# EAGLE board A314v1.2 (EAGLE 7.7.0)
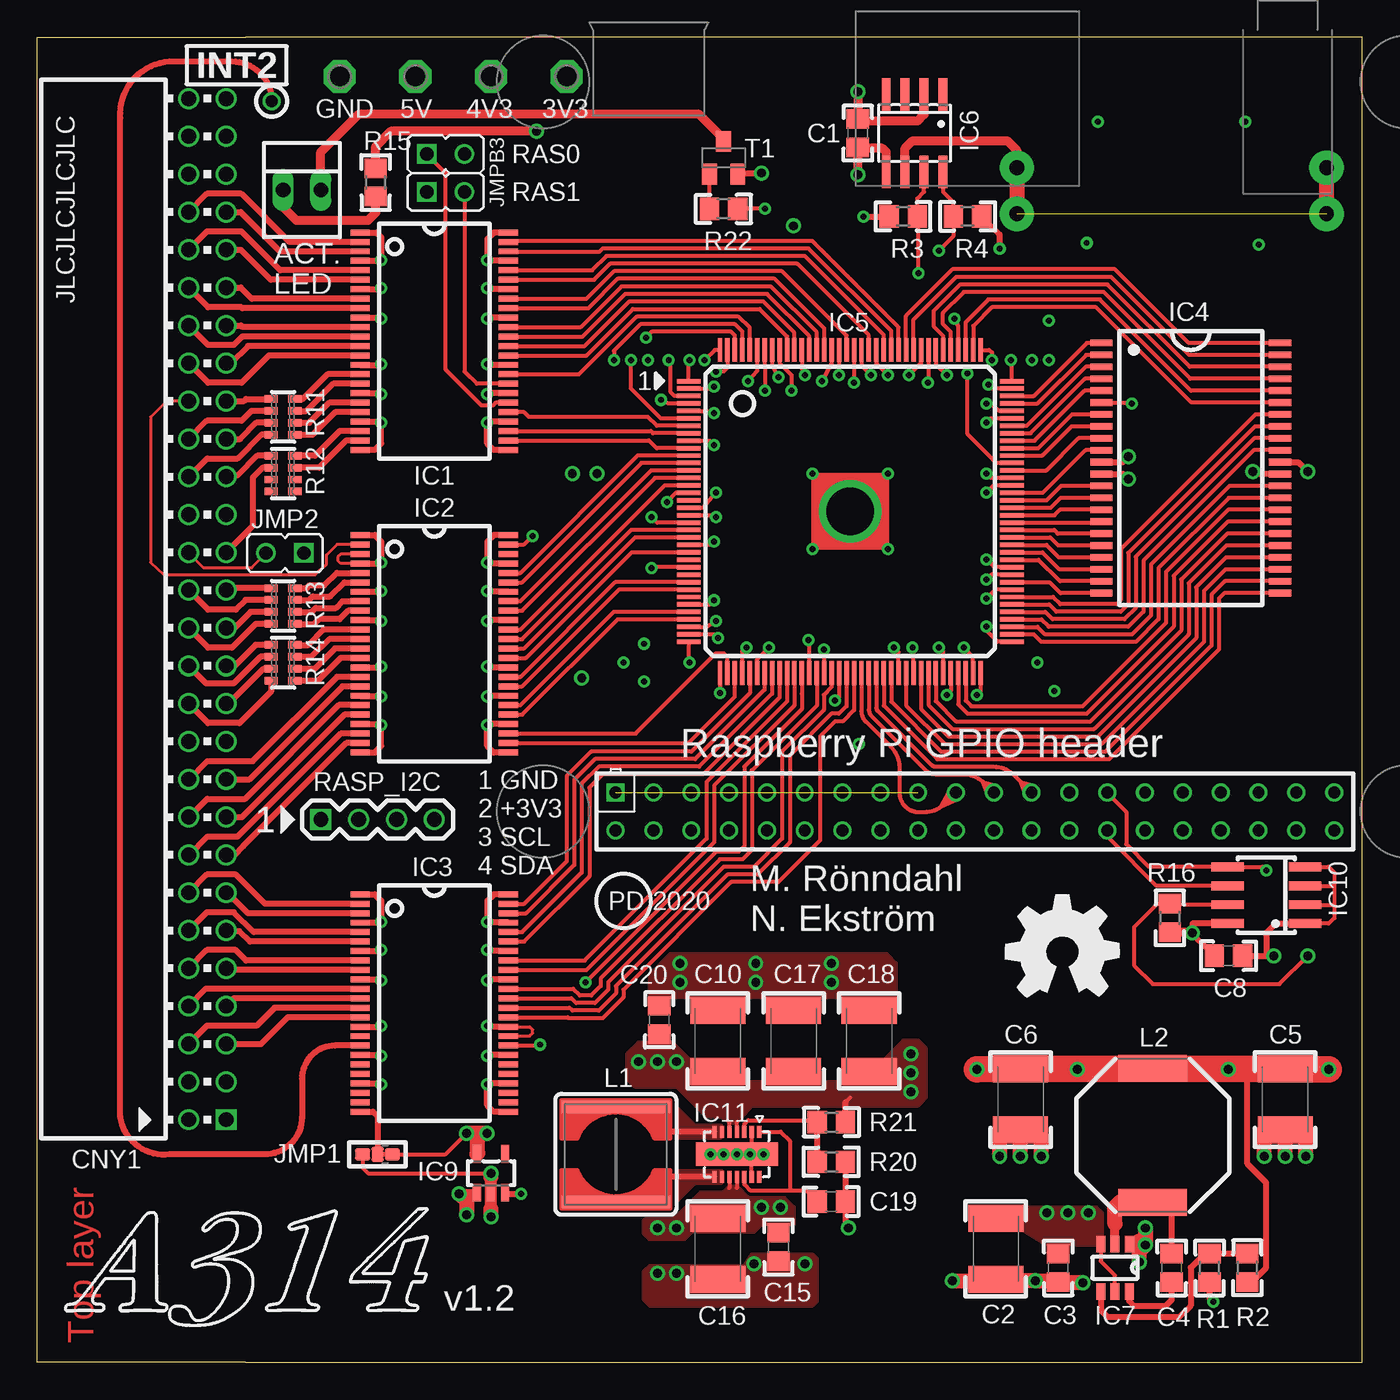
[diagram p4: board, top side]
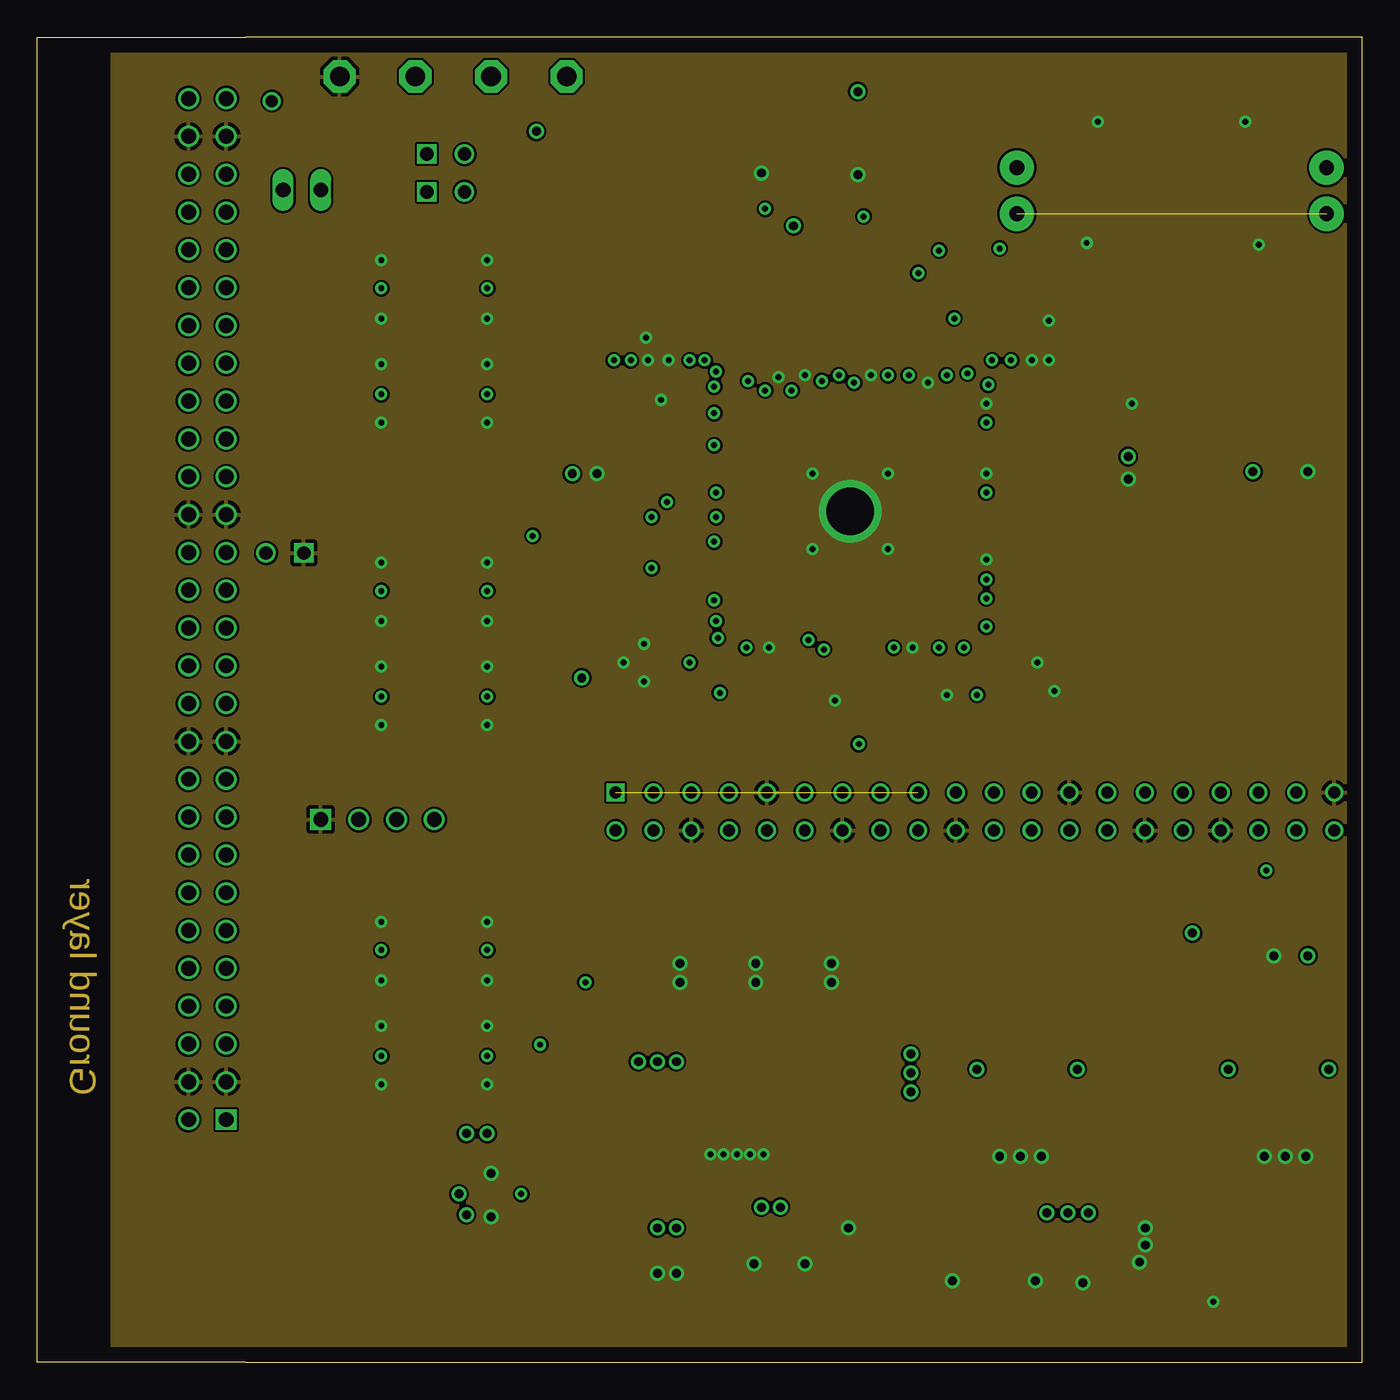
[diagram p5: board, inner layer Ground]
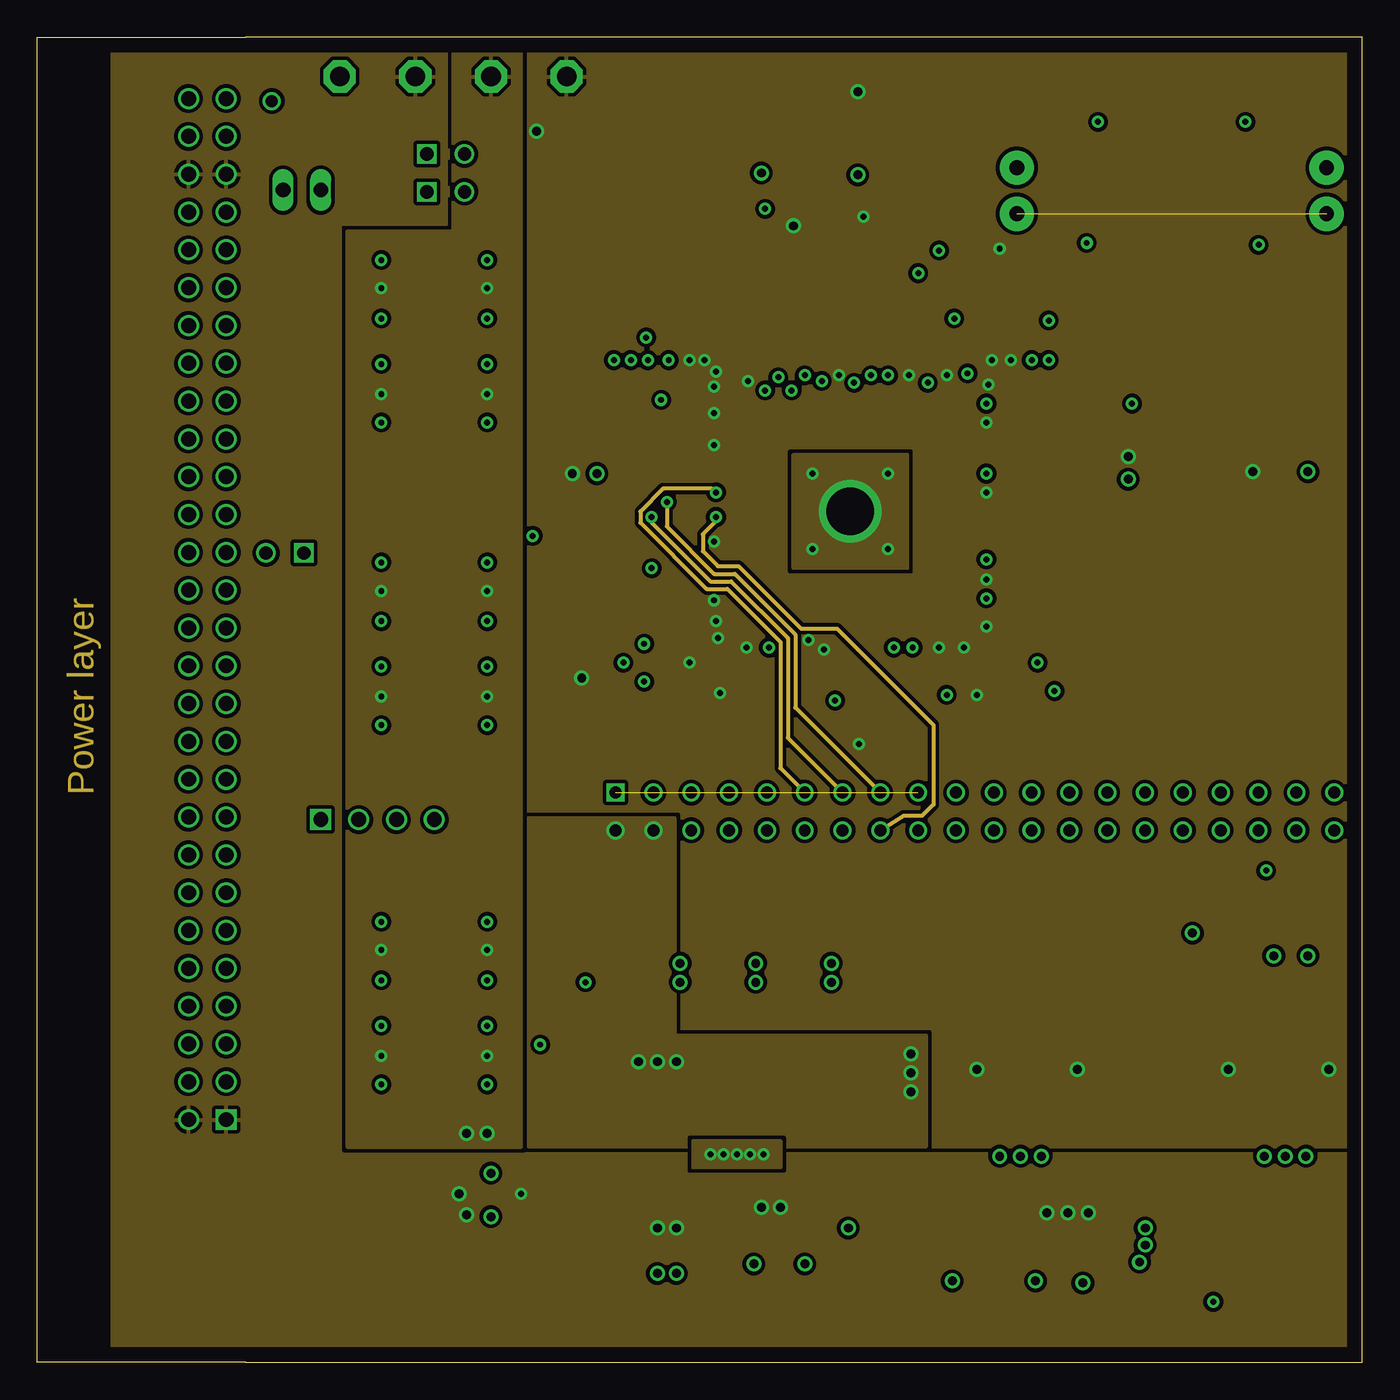
[diagram p6: board, inner layer Power]
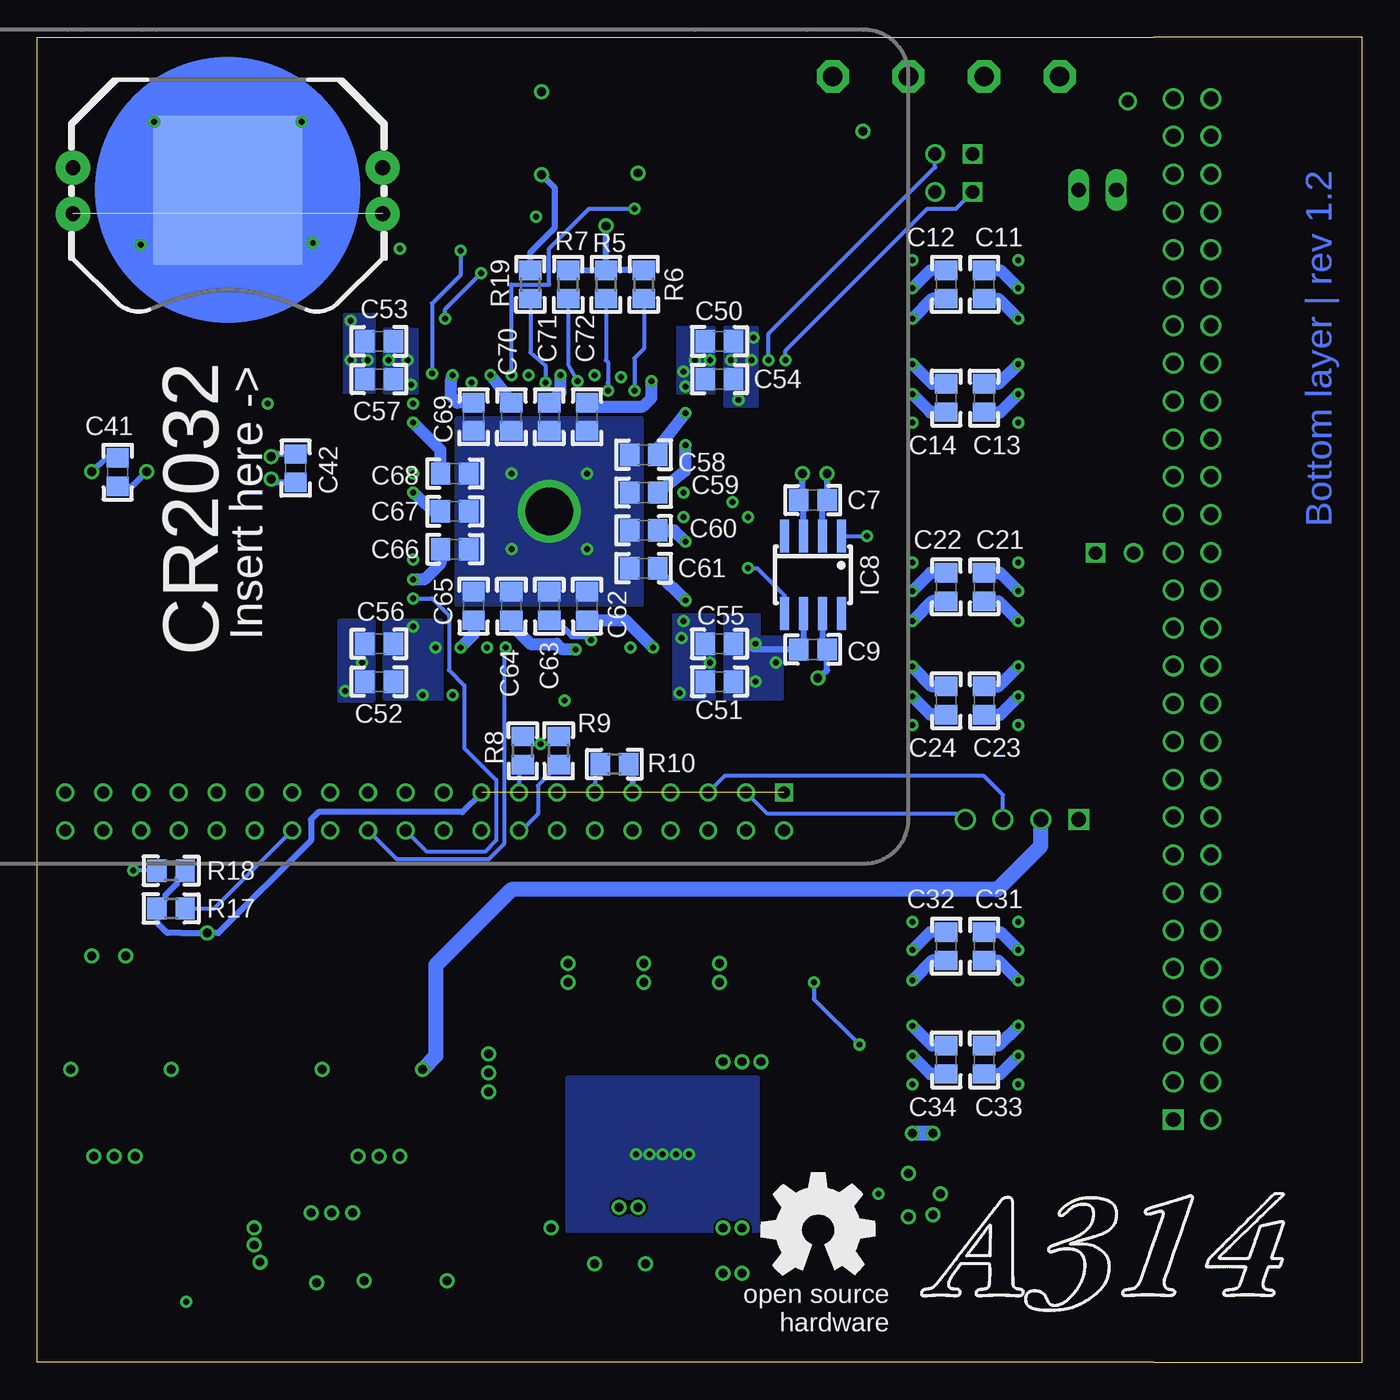
[diagram p7: board, bottom side, seen from below]

Size 89 x 89 mm. Coordinates in mm from the lower left corner, seen from the top.
Outline: 14,0 89,0 89,89 14,89
Copper layers (1+7*8+16): Top 0.035mm / dielectric 0.185mm / Ground 0.035mm / dielectric 1.15mm / Power 0.035mm / dielectric 0.185mm / Bottom 0.035mm
Design rules "AllPCB_6mil_std": minimum track width 8mil, minimum drill 0.4mm, track to track 6mil, track to pad 6mil, pad to pad 6mil, via to via 17mil, smd to smd 6mil, copper to edge 40mil, drill to drill 8mil, minimum pad ring 8mil, minimum via ring 8mil, stop-mask expansion 2mil, vias tented up to drill 0.6mm, thermal gap 10mil

## Footprints (pad centres in the part's own frame; a part is rotated, then mirrored left to right if it is on the bottom)
P1-13 = drill 1.321 pad 2.159 octagon: TP 0,0
LINX20XX-THM = drill 1 pad 2.3: +@1 -10.4,1.5; +@2 -10.4,-1.6; +@3 10.4,-1.6; +@4 10.4,1.5 | smd 10 x 10: GND 0,0
C0805 = smd 1.3 x 1.5: 1 -0.95,0; 2 0.95,0
C1812K = smd 1.8 x 3.7: 1 -2.05,0; 2 2.05,0
TRAPDOOR = drill 1 square: 1 12.7,16.3 | drill 1: 2 10.16,16.3; 3 12.7,18.84; 4 10.16,18.84; 5 12.7,21.38; 6 10.16,21.38; 7 12.7,23.92; 8 10.16,23.92; 9 12.7,26.46; 10 10.16,26.46; 11 12.7,29; 12 10.16,29; 13 12.7,31.54; 14 10.16,31.54; 15 12.7,34.08; 16 10.16,34.08; 17 12.7,36.62; 18 10.16,36.62; 19 12.7,39.16; 20 10.16,39.16; 21 12.7,41.7; 22 10.16,41.7; 23 12.7,44.24; 24 10.16,44.24; 25 12.7,46.78; 26 10.16,46.78; 27 12.7,49.32; 28 10.16,49.32; 29 12.7,51.86; 30 10.16,51.86; 31 12.7,54.4; 32 10.16,54.4; 33 12.7,56.94; 34 10.16,56.94; 35 12.7,59.48; 36 10.16,59.48; 37 12.7,62.02; 38 10.16,62.02; 39 12.7,64.56; 40 10.16,64.56; 41 12.7,67.1; 42 10.16,67.1; 43 12.7,69.64; 44 10.16,69.64; 45 12.7,72.18; 46 10.16,72.18; 47 12.7,74.72; 48 10.16,74.72; 49 12.7,77.26; 50 10.16,77.26; 51 12.7,79.8; 52 10.16,79.8; 53 12.7,82.34; 54 10.16,82.34; 55 12.7,84.88; 56 10.16,84.88
SSOP-DL48 = smd 1.3 x 0.4: 1 -4.98,7.303; 2 -4.98,6.668; 3 -4.98,6.032; 4 -4.98,5.397; 5 -4.98,4.763; 6 -4.98,4.128; 7 -4.98,3.493; 8 -4.98,2.857; 9 -4.98,2.223; 10 -4.98,1.587; 11 -4.98,0.953; 12 -4.98,0.318; 13 -4.98,-0.318; 14 -4.98,-0.953; 15 -4.98,-1.587; 16 -4.98,-2.223; 17 -4.98,-2.857; 18 -4.98,-3.493; 19 -4.98,-4.128; 20 -4.98,-4.763; 21 -4.98,-5.397; 22 -4.98,-6.032; 23 -4.98,-6.668; 24 -4.98,-7.303; 25 4.98,-7.303; 26 4.98,-6.668; 27 4.98,-6.032; 28 4.98,-5.397; 29 4.98,-4.763; 30 4.98,-4.128; 31 4.98,-3.493; 32 4.98,-2.857; 33 4.98,-2.223; 34 4.98,-1.587; 35 4.98,-0.953; 36 4.98,-0.318; 37 4.98,0.318; 38 4.98,0.953; 39 4.98,1.587; 40 4.98,2.223; 41 4.98,2.857; 42 4.98,3.493; 43 4.98,4.128; 44 4.98,4.763; 45 4.98,5.397; 46 4.98,6.032; 47 4.98,6.668; 48 4.98,7.303
TSOP-2 = smd 0.45 x 1.5: 1 -8.4,-6; 2 -7.6,-6; 3 -6.8,-6; 4 -6,-6; 5 -5.2,-6; 6 -4.4,-6; 7 -3.6,-6; 8 -2.8,-6; 9 -2,-6; 10 -1.2,-6; 11 -0.4,-6; 12 0.4,-6; 13 1.2,-6; 14 2,-6; 15 2.8,-6; 16 3.6,-6; 17 4.4,-6; 18 5.2,-6; 19 6,-6; 20 6.8,-6; 21 7.6,-6; 22 8.4,-6; 23 8.4,6; 24 7.6,6; 25 6.8,6; 26 6,6; 27 5.2,6; 28 4.4,6; 29 3.6,6; 30 2.8,6; 31 2,6; 32 1.2,6; 33 0.4,6; 34 -0.4,6; 35 -1.2,6; 36 -2,6; 37 -2.8,6; 38 -3.6,6; 39 -4.4,6; 40 -5.2,6; 41 -6,6; 42 -6.8,6; 43 -7.6,6; 44 -8.4,6
SQFP-S-20X20-144 = smd 0.3 x 1.6: 1 -8.75,-10.85; 2 -8.25,-10.85; 3 -7.75,-10.85; 4 -7.25,-10.85; 5 -6.75,-10.85; 6 -6.25,-10.85; 7 -5.75,-10.85; 8 -5.25,-10.85; 9 -4.75,-10.85; 10 -4.25,-10.85; 11 -3.75,-10.85; 12 -3.25,-10.85; 13 -2.75,-10.85; 14 -2.25,-10.85; 15 -1.75,-10.85; 16 -1.25,-10.85; 17 -0.75,-10.85; 18 -0.25,-10.85; 19 0.25,-10.85; 20 0.75,-10.85; 21 1.25,-10.85; 22 1.75,-10.85; 23 2.25,-10.85; 24 2.75,-10.85; 25 3.25,-10.85; 26 3.75,-10.85; 27 4.25,-10.85; 28 4.75,-10.85; 29 5.25,-10.85; 30 5.75,-10.85; 31 6.25,-10.85; 32 6.75,-10.85; 33 7.25,-10.85; 34 7.75,-10.85; 35 8.25,-10.85; 36 8.75,-10.85; 73 8.75,10.85; 74 8.25,10.85; 75 7.75,10.85; 76 7.25,10.85; 77 6.75,10.85; 78 6.25,10.85; 79 5.75,10.85; 80 5.25,10.85; 81 4.75,10.85; 82 4.25,10.85; 83 3.75,10.85; 84 3.25,10.85; 85 2.75,10.85; 86 2.25,10.85; 87 1.75,10.85; 88 1.25,10.85; 89 0.75,10.85; 90 0.25,10.85; 91 -0.25,10.85; 92 -0.75,10.85; 93 -1.25,10.85; 94 -1.75,10.85; 95 -2.25,10.85; 96 -2.75,10.85; 97 -3.25,10.85; 98 -3.75,10.85; 99 -4.25,10.85; 100 -4.75,10.85; 101 -5.25,10.85; 102 -5.75,10.85; 103 -6.25,10.85; 104 -6.75,10.85; 105 -7.25,10.85; 106 -7.75,10.85; 107 -8.25,10.85; 108 -8.75,10.85 | smd 1.6 x 0.3: 37 10.85,-8.75; 38 10.85,-8.25; 39 10.85,-7.75; 40 10.85,-7.25; 41 10.85,-6.75; 42 10.85,-6.25; 43 10.85,-5.75; 44 10.85,-5.25; 45 10.85,-4.75; 46 10.85,-4.25; 47 10.85,-3.75; 48 10.85,-3.25; 49 10.85,-2.75; 50 10.85,-2.25; 51 10.85,-1.75; 52 10.85,-1.25; 53 10.85,-0.75; 54 10.85,-0.25; 55 10.85,0.25; 56 10.85,0.75; 57 10.85,1.25; 58 10.85,1.75; 59 10.85,2.25; 60 10.85,2.75; 61 10.85,3.25; 62 10.85,3.75; 63 10.85,4.25; 64 10.85,4.75; 65 10.85,5.25; 66 10.85,5.75; 67 10.85,6.25; 68 10.85,6.75; 69 10.85,7.25; 70 10.85,7.75; 71 10.85,8.25; 72 10.85,8.75; 109 -10.85,8.75; 110 -10.85,8.25; 111 -10.85,7.75; 112 -10.85,7.25; 113 -10.85,6.75; 114 -10.85,6.25; 115 -10.85,5.75; 116 -10.85,5.25; 117 -10.85,4.75; 118 -10.85,4.25; 119 -10.85,3.75; 120 -10.85,3.25; 121 -10.85,2.75; 122 -10.85,2.25; 123 -10.85,1.75; 124 -10.85,1.25; 125 -10.85,0.75; 126 -10.85,0.25; 127 -10.85,-0.25; 128 -10.85,-0.75; 129 -10.85,-1.25; 130 -10.85,-1.75; 131 -10.85,-2.25; 132 -10.85,-2.75; 133 -10.85,-3.25; 134 -10.85,-3.75; 135 -10.85,-4.25; 136 -10.85,-4.75; 137 -10.85,-5.25; 138 -10.85,-5.75; 139 -10.85,-6.25; 140 -10.85,-6.75; 141 -10.85,-7.25; 142 -10.85,-7.75; 143 -10.85,-8.25; 144 -10.85,-8.75 | drill 0.4: GB@4 -2.54,-2.54; GP@1 -2.54,2.54; GP@2 2.54,2.54; GP@3 2.54,-2.54 | drill 3.2: GP@5 0,0
SOIC8 = smd 0.6 x 2.2: 1 -1.905,-2.6; 2 -0.635,-2.6; 3 0.635,-2.6; 4 1.905,-2.6; 5 1.905,2.6; 6 0.635,2.6; 7 -0.635,2.6; 8 -1.905,2.6
THIN_SO23 = smd 0.6 x 1.1: 1 -0.95,-1.6; 2 0,-1.6; 3 0.95,-1.6; 4 0.95,1.6; 5 0,1.6; 6 -0.95,1.6
SO08 = smd 0.6 x 2.2: 1 -1.905,-2.6; 2 -0.635,-2.6; 3 0.635,-2.6; 4 1.905,-2.6; 5 1.905,2.6; 6 0.635,2.6; 7 -0.635,2.6; 8 -1.905,2.6
SOT23-DBV = smd 0.55 x 1.2: 1 -0.95,-1.3; 2 0,-1.3; 3 0.95,-1.3; 4 0.95,1.3; 5 -0.95,1.3
SO-08 = smd 0.6 x 2.2: 1 -1.905,-2.6; 2 -0.635,-2.6; 3 0.635,-2.6; 4 1.905,-2.6; 5 1.905,2.6; 6 0.635,2.6; 7 -0.635,2.6; 8 -1.905,2.6
DSJ14_2P85X1P58 = smd 0.82 x 0.28: 1 -1.51,1.5; 2 -1.51,1; 3 -1.51,0.5; 4 -1.51,0; 5 -1.51,-0.5; 6 -1.51,-1; 7 -1.51,-1.5; 8 1.51,-1.5; 9 1.51,-1; 10 1.51,-0.5; 11 1.51,0; 12 1.51,0.5; 13 1.51,1; 14 1.51,1.5 | smd 1.58 x 5.5: 15 0,0 | drill 0.4 pad 0.61: V_1 0,1.778; V_2 0,-1.778; V_3 0,0; V_4 0,0.889; V_5 0,-0.889
P1-08 = drill 0.8: TP 0,0
C0R-JMP = smd 0.8 x 1: 1 0,1; 3 0,-1 | smd 1 x 0.8: 2 0,0
JP1 = drill 0.9 square: 1 0,-1.27 | drill 0.9: 2 0,1.27
WE-TPC_6823 = smd 0.8 x 7.3: 1 -3.2,0; 2 3.2,0
WE-TPC_1028/1038 = smd 4.6 x 1.8: 1 0,4.5; 2 0,-4.5
22-23-2021 = drill 1 long: 1 -1.27,0; 2 1.27,0
R0805 = smd 1.3 x 1.5: 1 -0.95,0; 2 0.95,0
CTS742C083 = smd 0.5 x 0.9: 1 -1.2,-0.8; 2 -0.4,-0.8; 3 0.4,-0.8; 4 1.2,-0.8; 5 1.2,0.8; 6 0.4,0.8; 7 -0.4,0.8; 8 -1.2,0.8
MA04-1 = drill 1 square: 1 -3.81,0 | drill 1: 2 -1.27,0; 3 1.27,0; 4 3.81,0
RASPI_BOARD_B+_FULL = drill 0.8 square: 1 8.37,51.23 | drill 0.8: 2 8.37,53.77; 3 10.91,51.23; 4 10.91,53.77; 5 13.45,51.23; 6 13.45,53.77; 7 15.99,51.23; 8 15.99,53.77; 9 18.53,51.23; 10 18.53,53.77; 11 21.07,51.23; 12 21.07,53.77; 13 23.61,51.23; 14 23.61,53.77; 15 26.15,51.23; 16 26.15,53.77; 17 28.69,51.23; 18 28.69,53.77; 19 31.23,51.23; 20 31.23,53.77; 21 33.77,51.23; 22 33.77,53.77; 23 36.31,51.23; 24 36.31,53.77; 25 38.85,51.23; 26 38.85,53.77; 27 41.39,51.23; 28 41.39,53.77; 29 43.93,51.23; 30 43.93,53.77; 31 46.47,51.23; 32 46.47,53.77; 33 49.01,51.23; 34 49.01,53.77; 35 51.55,51.23; 36 51.55,53.77; 37 54.09,51.23; 38 54.09,53.77; 39 56.63,51.23; 40 56.63,53.77
SOT23-BEC = smd 1 x 1.4: B -0.95,-1.1; C 0,1.1; E 0.95,-1.1

## Placement (x,y rotation side)
3V3  TPPAD1-13  [P1-13]  35.56,86.36 0 top
4V3  TPPAD1-13  [P1-13]  30.48,86.36 0 top
5V  TPPAD1-13  [P1-13]  25.4,86.36 0 top
BAT1  CR2025/CR2032TH  [LINX20XX-THM]  76.2,78.74 0 bottom
C1  100n  [C0805]  55.12,82.55 270 top
C2  22u  [C1812K]  64.39,7.62 270 top
C3  100n  [C0805]  68.58,6.35 90 top
C4  100n  [C0805]  76.2,6.35 90 top
C5  22u  [C1812K]  83.82,17.65 270 top
C6  22u  [C1812K]  66.04,17.65 270 top
C7  100n  [C0805]  36.89,57.91 180 bottom
C8  100n  [C0805]  80.01,27.3 0 top
C9  100n  [C0805]  36.89,47.88 180 bottom
C10  22u  [C1812K]  45.72,21.59 90 top
C11  100n  [C0805]  25.4,72.39 270 bottom
C12  100n  [C0805]  27.94,72.39 270 bottom
C13  100n  [C0805]  25.4,64.77 90 bottom
C14  100n  [C0805]  27.94,64.77 90 bottom
C15  100n  [C0805]  49.78,7.75 90 top
C16  22u  [C1812K]  45.72,7.62 270 top
C17  22u  [C1812K]  50.8,21.59 90 top
C18  22u  [C1812K]  55.88,21.59 90 top
C19  100n  [C0805]  53.34,10.79 180 top
C20  100n  [C0805]  41.78,22.99 270 top
C21  100n  [C0805]  25.4,52.07 270 bottom
C22  100n  [C0805]  27.94,52.07 270 bottom
C23  100n  [C0805]  25.4,44.45 90 bottom
C24  100n  [C0805]  27.94,44.45 90 bottom
C31  100n  [C0805]  25.4,27.94 270 bottom
C32  100n  [C0805]  27.94,27.94 270 bottom
C33  100n  [C0805]  25.4,20.32 90 bottom
C34  100n  [C0805]  27.94,20.32 90 bottom
C41  100n  [C0805]  83.6,59.8 90 bottom
C42  100n  [C0805]  71.64,60.05 270 bottom
C50  33u  [C0805]  43.18,68.58 0 bottom
C51  33u  [C0805]  43.18,45.72 0 bottom
C52  33u  [C0805]  66.04,45.72 180 bottom
C53  33u  [C0805]  66.04,68.58 180 bottom
C54  100n  [C0805]  43.18,66.04 0 bottom
C55  100n  [C0805]  43.18,48.26 0 bottom
C56  100n  [C0805]  66.04,48.26 180 bottom
C57  100n  [C0805]  66.04,66.04 180 bottom
C58  100n  [C0805]  48.26,60.96 180 bottom
C59  100n  [C0805]  48.26,58.42 180 bottom
C60  100n  [C0805]  48.26,55.88 180 bottom
C61  100n  [C0805]  48.26,53.34 180 bottom
C62  100n  [C0805]  52.07,50.8 90 bottom
C63  100n  [C0805]  54.61,50.8 90 bottom
C64  100n  [C0805]  57.15,50.8 90 bottom
C65  100n  [C0805]  59.69,50.8 90 bottom
C66  100n  [C0805]  60.96,54.61 0 bottom
C67  100n  [C0805]  60.96,57.15 0 bottom
C68  100n  [C0805]  60.96,59.69 0 bottom
C69  100n  [C0805]  59.69,63.5 270 bottom
C70  100n  [C0805]  57.15,63.5 270 bottom
C71  100n  [C0805]  54.61,63.5 270 bottom
C72  100n  [C0805]  52.07,63.5 270 bottom
CNY1  A500TD  [TRAPDOOR]  0,0 0 top
GND  TPPAD1-13  [P1-13]  20.32,86.36 0 top
IC1  SN74CBT16244CDL  [SSOP-DL48]  26.67,68.58 0 top
IC2  SN74CBT16244CDL  [SSOP-DL48]  26.67,48.26 0 top
IC3  SN74CBT16244CDL  [SSOP-DL48]  26.67,24.13 0 top
IC4  IS61WV51216BLL-10TLI  [TSOP-2]  77.48,60.06 270 top
IC5  10M08SCE144  [SQFP-S-20X20-144]  54.61,57.15 270 top
IC6  DS3231M  [SOIC8]  58.93,82.55 180 top
IC7  [THIN_SO23]  72.39,6.35 180 top
IC8  NB3N502  [SO08]  36.89,52.9 180 bottom
IC9  TPS77033  [SOT23-DBV]  30.48,12.7 0 top
IC10  24AA32ASN  [SO-08]  82.55,31.37 90 top
IC11  TPS63020DSJR  [DSJ14_2P85X1P58]  46.99,13.97 270 top
INT2  TP1  [P1-08]  15.75,84.71 0 top
JMP1  0R-JUMPC  [C0R-JMP]  22.86,13.97 270 top
JMP2  [JP1]  16.64,54.36 90 top
JMP3  RAS0  [JP1]  27.43,81.15 270 top
JMPB3  [JP1]  27.43,78.61 270 top
L1  1uH  [WE-TPC_6823]  38.86,13.97 90 top
L2  2.2uH  [WE-TPC_1028/1038]  74.93,15.24 180 top
LED  22-23-2021  [22-23-2021]  17.78,78.74 0 top
R1  10k2  [R0805]  78.74,6.35 90 top
R2  34k  [R0805]  81.28,6.35 270 top
R3  3k9  [R0805]  58.17,76.96 180 top
R4  3k9  [R0805]  62.48,76.96 0 top
R5  10k  [R0805]  50.8,72.39 270 bottom
R6  10k  [R0805]  48.26,72.39 270 bottom
R7  10k  [R0805]  53.34,72.39 270 bottom
R8  10k  [R0805]  56.39,41.08 90 bottom
R9  10k  [R0805]  53.98,41.08 90 bottom
R10  1k  [R0805]  50.23,40.18 180 bottom
R11  47  [CTS742C083]  16.51,63.5 270 top
R12  47  [CTS742C083]  16.51,59.69 270 top
R13  47  [CTS742C083]  16.51,50.8 270 top
R14  47  [CTS742C083]  16.51,46.99 270 top
R15  68  [R0805]  22.73,79.25 90 top
R16  1k  [R0805]  76.07,29.84 270 top
R17  3k9  [R0805]  80.01,30.48 0 bottom
R18  3k9  [R0805]  80.01,33.02 0 bottom
R19  10k  [R0805]  55.88,72.39 270 bottom
R20  143k  [R0805]  53.34,13.46 180 top
R21  1M33  [R0805]  53.34,16.13 0 top
R22  1k  [R0805]  46.1,77.47 180 top
RASP_I2C  [MA04-1]  22.86,36.45 0 top
RP1  RASPI_BOARD_B+_F  [RASPI_BOARD_B+_FULL]  30.48,89.5 180 bottom
T1  2N4401  [SOT23-BEC]  46.1,80.9 0 top
U$1  [OSHW_8_NOTEXT]  68.83,27.56 0 top
U$2  [A314_LOGO]  1.78,2.41 0 top
U$3  [A314_LOGO]  29.72,3.43 0 bottom
U$4  [OSHW_8MM]  36.58,8.89 0 bottom

## Tracks (layer width: path | path; a pad name or v marks a point on that pad's centre or on a via)
3VA0
  Top 0.254: IC2.36 32.7,47.94 40.16,55.4 IC5.22
3VA1
  Top 0.254: IC2.35 32.83,47.31 39.92,54.4 IC5.24
3VA2
  Top 0.254: IC2.38 32.45,49.21 42.14,58.9 IC5.15
3VA3
  Top 0.254: IC2.37 32.58,48.58 39.9,55.9 IC5.21
3VA4
  Top 0.254: IC2.41 32.45,51.12 41.23,59.9 IC5.13
3VA5
  Top 0.254: IC2.40 32.58,50.48 41.49,59.4 IC5.14
3VA6
  Top 0.254: IC2.44 32.45,53.02 40.33,60.9 IC5.11
3VA7
  Top 0.254: IC2.43 32.58,52.39 40.26,60.07 40.51,60.33 40.59,60.4 IC5.12
3VA8
  Top 0.254: IC1.26 41.08,61.91 41.6,61.4 IC5.10
3VCASL
  Top 0.254: IC1.27 41.21,62.55 41.36,62.4 IC5.8
3VCASU
  Top 0.254: IC5.7 41.62,62.9 41.02,63.5 33.02,63.5 32.7,63.82 IC1.29
3VCCK  (via drill 0.4)
  Top 0.254: IC2.47 32.7,54.93 v33.27,55.5
  Bottom 0.254: IC8.1 33.53,55.49 v33.27,55.5
3VCPA2
  Top 0.254: IC5.127 54.36,68.96 50.04,73.28 38.73,73.28 36.89,71.44 IC1.41
3VCPA3
  Top 0.254: IC5.130 52.86,69.44 49.53,72.77 38.99,72.77 37.02,70.8 IC1.40
3VCPA4
  Top 0.254: IC5.124 55.86,68.98 51.05,73.79 38.48,73.79 37.4,72.71 IC1.43
3VCPA5
  Top 0.254: IC5.122 56.86,69 51.56,74.3 38.23,74.3 37.27,73.34 IC1.44
3VCPD0
  Top 0.254: IC5.134 50.86,69.16 48.77,71.25 39.75,71.25 36.77,68.26 IC1.36
3VCPD1
  Top 0.254: IC1.35 36.89,67.63 40.01,70.74 48.51,70.74 50.36,68.89 IC5.135
3VCPD2
  Top 0.254: IC5.131 52.36,69.18 49.28,72.26 39.24,72.26 36.51,69.53 IC1.38
3VCPD3
  Top 0.254: IC5.132 51.86,68.92 49.02,71.75 39.5,71.75 36.64,68.9 IC1.37
3VCPRD
  Top 0.254: IC5.121 57.36,69.26 51.82,74.8 37.97,74.8 37.78,74.61 IC1.46
3VCPWR
  Top 0.254: IC5.120 57.86,69.52 52.07,75.31 31.71,75.31 IC1.47
3VD0
  Top 0.254: IC5.55 54.86,43.81 54.1,43.05 53.59,43.05 52.58,42.04 52.58,35.05 49.78,32.26 46.61,32.26 39.37,25.02 39.37,24.51 37.97,23.11 35.69,23.11 35.62,23.18 IC3.35
3VD1
  Top 0.254: IC5.54 54.36,44.07 53.85,43.56 53.34,43.56 50.55,40.77 50.55,34.92 48.39,32.77 46.35,32.77 38.86,25.27 38.86,24.77 37.72,23.62 35.94,23.62 35.75,23.81 IC3.36
3VD2
  Top 0.254: IC5.52 53.36,45.36 52.83,44.83 52.83,43.81 50.04,41.02 50.04,35.18 48.13,33.27 46.1,33.27 38.35,25.53 38.35,25.02 37.47,24.13 36.2,24.13 35.88,24.45 IC3.37
3VD3
  Top 0.254: IC5.50 52.36,44.1 48.01,39.75 48.01,34.42 47.37,33.78 45.85,33.78 37.85,25.78 37.85,25.27 37.21,24.64 36.45,24.64 36.01,25.08 IC3.38
3VD4
  Top 0.254: IC5.47 50.86,44.13 45.47,38.73 45.47,34.92 36.89,26.35 IC3.40
3VD5
  Top 0.254: IC5.46 50.36,44.39 44.96,38.99 44.96,35.18 36.77,26.99 IC3.41
3VD6
  Top 0.254: IC5.45 49.86,44.65 44.7,39.5 37.97,39.5 37.08,38.61 37.08,32.64 32.7,28.26 IC3.43
3VD7
  Top 0.254: IC5.44 49.36,44.91 44.45,40.01 37.72,40.01 36.58,38.86 36.58,32.89 32.58,28.89 IC3.44
3VD8
  Top 0.254: IC5.43 48.86,45.18 44.2,40.51 37.47,40.51 36.07,39.12 36.07,33.4 32.83,30.16 IC3.46
3VD9
  Top 0.254: IC5.41 47.86,44.94 43.94,41.02 37.21,41.02 35.56,39.37 35.56,33.66 32.7,30.8 IC3.47
3VD10
  Top 0.254: IC2.26 43.75,41.59 46.86,44.7 IC5.39
3VD11
  Top 0.254: IC2.27 40.2,42.23 45.59,47.62 46.1,47.62 46.36,47.37 IC5.38
3VD12
  Top 0.254: IC2.29 32.58,43.5 38.98,49.9 IC5.33
3VD13
  Top 0.254: IC2.30 32.45,44.13 38.72,50.4 IC5.32
3VD14
  Top 0.254: IC2.32 32.58,45.4 39.07,51.9 IC5.29
3VD15
  Top 0.254: IC2.33 32.45,46.04 38.81,52.4 IC5.28
3VINT2A  (via drill 0.4)
  Top 0.254: IC5.48 51.36,44.91 51.36,43.87 47.5,40.01 47.5,34.67 47.12,34.29 46.1,34.29 45.59,34.29 v36.83,25.53 | IC3.32 33.72,21.27 v33.78,21.34
  Bottom 0.254: v36.83,25.53 36.83,24.38 v33.78,21.34
3VRAS0  (via drill 0.4)
  Top 0.254: IC5.6 41.88,63.4 39.88,65.41 v39.88,67.31
  Bottom 0.254: v39.88,67.31 39.88,69.09 28.7,80.26 JMP3.2
3VRAS1  (via drill 0.4)
  Top 0.254: IC5.141 47.36,69.23 46.86,69.72 40.51,69.72 38.73,67.94 v38.73,67.31
  Bottom 0.254: v38.73,67.31 38.73,67.94 29.21,77.47 27.3,77.47 JMPB3.1
3VWE
  Top 0.254: IC5.140 47.86,69.49 47.12,70.23 40.26,70.23 36.39,66.36 IC1.33
14MHZ  (via drill 0.4)
  Top 0.254: IC5.26 41.34,53.4 v41.27,53.34
  Bottom 0.254: v41.27,53.34 40.64,53.34 38.8,51.5 IC8.5
!CFG  (via drill 0.4)
  Top 0.254: IC5.129 53.36,67.08 v52.7,65.91
  Bottom 0.254: R7.2 53.34,67.06 v52.7,65.91
!STAT  (via drill 0.4)
  Top 0.254: IC5.136 49.86,67.11 50.04,66.93 50.67,66.29 50.67,65.79 v50.67,65.28
  Bottom 0.254: R5.2 50.8,67.31 50.67,67.18 50.67,65.79 v50.67,65.28
+  (1 unrouted)
  Top 0.61: IC6.6 58.29,81.53 58.8,82.04 65.15,82.04 65.79,81.41 65.79,80.25 BAT1.+@4
  Top 1.016: BAT1.+@4 BAT1.+@3 | BAT1.+@2 BAT1.+@1
+3V3  (via drill 0.4, 0.6)
  Top 0.254: IC5.49 51.86,48.47 v51.82,48.51 | IC5.51 52.86,47.72 v52.83,47.88 | IC5.40 47.36,47.74 v47.62,48.01 | IC5.37 45.86,45.33 v45.85,44.96 | IC5.31 45.19,50.9 v45.47,51.18 | IC5.36 43.76,47.05 v43.81,46.99 | IC5.35 45.59,48.9 v45.72,48.64 | IC5.34 44.95,49.4 v45.59,49.78 | v45.47,55.12 45.18,54.9 IC5.23 | IC5.9 45.16,61.9 v45.47,61.59 | IC5.5 45.19,63.9 v45.47,63.75 | IC5.143 46.36,66.81 46.1,66.55 v45.59,66.55 | IC5.144 45.52,68 v44.83,67.31 | IC5.1 43.76,67.25 v43.81,67.31 | IC5.2 45.33,65.4 v45.47,65.53 | IC5.139 48.36,66.58 v47.75,65.91 | IC5.128 53.86,66.56 v53.85,66.29 | IC5.117 59.36,67.11 v58.55,66.29 | IC5.115 60.36,67.02 v61.09,66.29 | IC5.109 63.95,68 64.14,67.82 v64.14,67.31 | IC5.108 65.46,67.25 v65.41,67.31 | IC5.107 64.14,65.4 v63.88,65.66 | IC5.103 64.03,63.4 v63.75,63.12 | IC5.94 64.23,58.9 v63.75,58.42 | IC5.73 64.5,48.4 63.75,49.15 v63.75,49.4 | IC5.72 63.36,45.07 v63.12,44.83 | IC5.71 62.86,47.38 v62.23,48.01 | IC5.67 60.86,47.73 v60.58,48.01 | IC5.82 64.08,52.9 v63.75,52.58
  Top 0.406: 74.93,20.32 L2.2 | R2.2 81.6,5.4 82.55,6.35 82.55,12.06 81.28,13.34 81.28,19.7 | IC4.11 72.91,60.46 v73.28,60.83 | IC4.33 81.82,59.66 v81.66,59.82 | v55.5,76.96 R3.2 | v64.64,74.8 64.64,75.75 R4.2
  Top 0.61: IC6.2 59.56,83.82 59.12,83.37 55.24,83.37 C1.1 v55.12,85.34 | R15.2 22.73,81.66 23.75,82.68 v33.53,82.68
  Top 1.778: C5.1 81.28,19.7 74.97,19.7 L2.2 74.89,19.7 C6.1 v63.12,19.68 | v86.74,19.68 83.82,19.68
  Bottom 0.254: R9.2 54.48,41.53 v55.18,41.53 55.88,41.53 R8.2
  Bottom 0.406: C61.1 47.31,53.02 | C58.1 47.31,61.4 | C70.1 57.15,64.52 | C67.1 62.36,57.15 | C63.1 54.17,49.85 53.09,48.77 51.82,48.77 v51.82,48.51 | C64.1 57.15,49.53 | IC8.7 36.26,48.19 C9.1 35.94,46.48 v36.58,45.97 | IC8.2 36.26,57.6 C7.1 35.94,58.55 v35.94,59.69 | R6.1 R5.1 | R7.1 R5.1 | R5.1 v50.8,76.33 | C41.1 82.63,58.84 v81.66,59.82 | C42.1 73.11,61 v73.28,60.83
  Bottom 0.813: C65.1 59.69,48.9 v60.58,48.01 | v63.75,52.58 62.99,52.58 61.91,53.66 C66.1 | C62.1 49.47,49.85 v47.62,48.01 | 47.31,53.02 v45.47,51.18 | C60.1 46.23,55.88 v45.47,55.12 | C59.1 45.47,59.88 v45.47,61.59 | 47.31,61.4 v45.47,63.75 | C72.1 51.37,64.2 48.33,64.2 47.75,64.77 v47.75,65.91 | C71.1 53.85,65.15 v53.85,66.29 | 57.15,64.52 v58.55,66.29 | C68.1 61.91,61.27 v63.75,63.12 | 62.36,57.15 v63.75,58.42 | 57.15,49.53 55.88,48.26 54.1,48.26 53.72,47.88 v52.83,47.88 | C69.1 60.77,64.45 61.21,64.9 61.21,65.91 v61.09,66.29
  Bottom 1.016: v63.12,19.68 62.23,20.57 62.23,26.67 57.15,31.75 24.51,31.75 21.59,34.67 RASP_I2C.2
  other vias: 69.85,19.68 80.01,19.68
  pour Power (isolate 0.254, rank 5): 33.02,88.9 88.9,88.9 88.9,14.48 33.02,14.48
  pour Bottom (no thermals): 65.66,44.58 61.85,44.58 61.85,49.78 65.66,49.78
  pour Bottom (no thermals): 46.23,44.58 43.56,44.58 43.56,50.16 46.23,50.16
  pour Bottom (no thermals): 45.97,69.47 45.97,65.15 43.56,65.15 43.56,69.47
  pour Bottom (no thermals): 65.66,65.15 63.5,65.15 63.5,69.34 65.66,69.34
+4.3V  (via drill 0.4, 0.6)
  Top 0.254: JMP1.1 27.43,13.97 v28.83,15.37
  Top 0.406: IC1.7 23.05,72.07 v23.11,72.14 | IC1.42 30.29,72.07 v30.23,72.14 | IC1.31 30.29,65.09 v30.23,65.02 | IC1.18 23.05,65.09 v23.11,65.02 | IC2.7 23.05,51.75 v23.11,51.82 | IC2.42 30.29,51.75 v30.23,51.82 | IC2.18 23.05,44.77 v23.11,44.7 | IC2.31 30.29,44.77 v30.23,44.7 | IC3.7 23.05,27.62 v23.11,27.69 | IC3.42 30.29,27.62 v30.23,27.69 | IC3.18 23.05,20.64 v23.11,20.57 | IC3.31 30.29,20.64 v30.23,20.57
  Top 1.016: IC9.5 29.59,14.06 29.59,15.37 | 29.59,15.37 v28.83,15.37 | v30.23,15.37 29.59,15.37
  Bottom 0.813: C11.1 24.32,73.34 v23.11,72.14 | C12.1 29.02,73.34 v30.23,72.14 | C13.1 24.32,63.82 v23.11,65.02 | C14.1 29.02,63.82 v30.23,65.02 | C21.1 24.32,53.02 v23.11,51.82 | C22.1 29.02,53.02 v30.23,51.82 | C24.1 29.02,43.5 v30.23,44.7 | C23.1 24.32,43.5 v23.11,44.7 | C31.1 24.32,28.89 v23.11,27.69 | C32.1 29.02,28.89 v30.23,27.69 | C33.1 24.32,19.37 v23.11,20.57 | C34.1 29.02,19.37 v30.23,20.57
  Bottom 1.016: v28.83,15.37 v30.23,15.37
  pour Power (isolate 0.254, rank 2): 20.83,75.95 20.83,14.48 32.51,14.48 32.51,88.65 27.94,88.65 27.94,75.95
+5V  (via drill 0.4, 0.6)
  Top 0.254: IC7.5 72.39,5.84 71.44,6.79 IC7.3 | IC11.10 46.49,11.69 46.48,11.68 | IC11.11 46.99,11.68
  Top 0.406: IC9.3 31.53,11.3 v32.51,11.3 | IC7.3 71.44,8.19
  Top 0.61: 28.83,10.92 29.05,10.92 IC9.1 29.43,11.3 v28.32,11.3
  Top 1.016: v28.32,11.3 28.83,10.92 v28.83,9.91
  Top 1.27: 65.42,9.67 C2.1
  other vias: 67.82,10.03 69.22,10.03 70.61,10.03 41.66,9.02 42.93,9.02 48.64,10.41 49.91,10.41
  pour Power (isolate 0.254, rank 6): 5.08,0 5.08,88.9 27.56,88.9 27.56,76.45 20.32,76.45 20.32,15.24 88.9,15.24 88.9,0
  pour Top (no thermals): 66.17,10.41 71.12,10.41 71.5,10.03 71.5,7.87 67.82,7.87 66.17,8.89
  pour Top (no thermals): 40.77,8.64 40.77,9.53 41.02,9.78 42.93,9.78 44.58,11.43 46.1,11.43 46.48,11.81 46.99,11.81 47.75,11.05 50.16,11.05 50.8,10.41 50.8,9.27 48.64,9.27 48.13,8.76 43.94,8.76 43.43,8.26 41.15,8.26
+5V/1  (via drill 0.6)
  Top 0.254: IC11.5 46.48,16.13 | IC11.4 46.99,16.13 | 54.29,17.46 54.61,17.78
  Top 0.406: R21.2 54.29,17.46
  other vias: 58.67,20.7 58.67,19.43 58.67,18.16 42.93,20.19 41.66,20.19 40.39,20.19
  pour Power (isolate 0.254, rank 4, no thermals): 33.02,14.48 33.02,36.58 42.8,36.58 42.8,21.97 59.69,21.97 59.69,14.48
  pour Top (no thermals): 42.67,21.46 40.39,21.46 39.62,20.7 39.62,19.05 40.13,18.54 42.93,18.54 44.96,16.51 45.97,16.51 46.48,16.13 46.99,16.13 48.01,17.27 59.18,17.27 59.69,17.78 59.69,21.08 59.18,21.59 58.17,21.59 55.37,18.8 45.34,18.8
A2
  Top 0.406: CNY1.45 13.67,72.18 14.41,71.44 IC1.8
A3
  Top 0.406: CNY1.46 11.47,70.87 13.72,70.87 13.78,70.8 IC1.9
A4
  Top 0.406: IC1.6 15.68,72.71 13.67,74.72 CNY1.47
A5
  Top 0.406: IC1.5 16.32,73.34 13.72,75.95 11.39,75.95 CNY1.48
BST1
  Top 0.406: IC7.6 73.34,4.13 73.66,3.81 75.82,3.81 76.2,4.19 C4.1
CFG_DNE  (via drill 0.4)
  Top 0.254: IC5.138 48.86,66.96 48.9,66.8 v48.9,65.28
  Bottom 0.254: R6.2 48.26,68.07 48.9,67.44 v48.9,65.28
CFG_SEL  (via drill 0.4)
  Top 0.254: IC5.126 54.86,66.04 v54.86,65.79
  Bottom 0.254: R19.2 55.88,67.82 54.86,66.93 v54.86,65.79
CLKRD
  Top 0.406: IC1.3 16.32,74.61 13.67,77.26 CNY1.49
CLKWR
  Top 0.406: IC1.2 16.95,75.25 13.72,78.49 11.39,78.49 CNY1.50
D0
  Top 0.406: IC1.13 14.16,68.26 13,67.1 CNY1.41
D1
  Top 0.406: CNY1.42 11.47,65.79 13.72,65.79 15.56,67.63 IC1.14
D2
  Top 0.406: CNY1.43 13.67,69.64 13.78,69.53 IC1.11
D3
  Top 0.406: CNY1.44 11.47,68.33 13.21,68.33 13.78,68.9 IC1.12
DRA0
  Top 0.406: R14.3 15.22,46.59 12.87,44.24 CNY1.23
DRA1
  Top 0.406: R14.4 15.71,45.05 13.59,42.93 11.47,42.93 CNY1.24
DRA2
  Top 0.406: R14.1 14.66,48.19 13.25,46.78 CNY1.25
DRA3
  Top 0.406: R14.2 15.01,47.39 13.21,45.59 11.35,45.59 CNY1.26
DRA4
  Top 0.406: R13.3 14.33,50.4 13.25,49.32 CNY1.27
DRA5
  Top 0.406: R13.4 14.68,49.6 13.08,48.01 11.47,48.01 CNY1.28
DRA6
  Top 0.406: R13.1 12.84,52 CNY1.29
DRA7
  Top 0.406: R13.2 13.99,51.2 13.34,50.55 11.47,50.55 CNY1.30
DRA8
  Top 0.406: R12.2 15.13,60.09 14.48,59.44 14.48,56.18 CNY1.31
DRA8_L
  Top 0.406: IC1.23 20.77,61.91 18.94,60.09 R12.7
DRAS0
  Top 0.406: R11.3 14.71,63.1 13.63,62.02 CNY1.37
DRAS0_L
  Top 0.406: R11.6 18.27,63.1 19.62,64.45 IC1.19
DRAS1
  Top 0.406: R11.2 14.37,63.9 13.72,63.25 11.39,63.25 CNY1.38
DRAS1_L
  Top 0.406: R11.7 18.05,63.9 19.88,65.72 IC1.17
DRCASL
  Top 0.406: R12.1 14.79,60.89 13.46,59.56 12.78,59.56 CNY1.35
DRCASL_L
  Top 0.406: IC1.22 20.32,62.55 18.66,60.89 R12.8
DRCASU
  Top 0.406: CNY1.36 10.2,59.48 11.43,60.71 13.46,60.71 15.06,62.3 R11.4
DRCASU_L
  Top 0.406: R11.5 18.48,62.3 20,63.82 IC1.20
DRCCK
  Top 0.21: CNY1.40 8.68,64.56 7.62,63.5 7.62,53.72 8.51,52.9 18.67,52.9 19.43,53.59 19.43,54.23 20.13,54.93 IC2.2
DRD0
  Top 0.406: IC3.14 16.83,23.18 15.03,21.38 CNY1.5
DRD1
  Top 0.406: IC3.13 15.94,23.81 14.73,22.61 11.39,22.61 CNY1.6
DRD2
  Top 0.406: IC3.12 13.23,24.45 CNY1.7
DRD3
  Top 0.406: IC3.11 11.32,25.08 CNY1.8
DRD4
  Top 0.406: IC3.9 12.81,26.35 CNY1.9
DRD5
  Top 0.406: IC3.8 14.03,26.99 13.34,27.69 11.39,27.69 CNY1.10
DRD6
  Top 0.406: IC3.6 14.29,28.26 13.59,28.96 12.74,28.96 CNY1.11
DRD7
  Top 0.406: IC3.5 14.54,28.89 13.21,30.23 11.39,30.23 CNY1.12
DRD8
  Top 0.406: IC3.3 14.16,30.16 12.83,31.5 12.74,31.5 CNY1.13
DRD9
  Top 0.406: IC3.2 15.3,30.8 13.34,32.77 11.39,32.77 CNY1.14
DRD10
  Top 0.406: IC2.23 20.77,41.59 13.84,34.67 13.25,34.08 CNY1.15
DRD11
  Top 0.406: CNY1.16 10.2,34.08 11.43,35.31 13.46,35.31 20.38,42.23 IC2.22
DRD12
  Top 0.406: CNY1.17 13.76,36.62 20.64,43.5 IC2.20
DRD13
  Top 0.406: CNY1.18 10.2,36.62 11.43,37.85 13.97,37.85 20.26,44.13 IC2.19
DRD14
  Top 0.406: CNY1.19 14.27,39.16 20.51,45.4 IC2.17
DRD15
  Top 0.406: CNY1.20 10.2,39.16 11.43,40.39 14.48,40.39 20.13,46.04 IC2.16
DRWE
  Top 0.406: CNY1.39 13.89,64.56 14.03,64.7 R11.1
DRWE_L
  Top 0.406: R11.8 17.84,64.7 19.49,66.36 IC1.16
EXRAM
  Top 0.21: CNY1.32 11.16,53.37 14.41,53.37 JMP2.2
FB1
  Top 0.406: IC7.4 71.44,3.49 71.88,3.05 76.71,3.05 77.47,3.81 77.47,6.35 78.42,7.3 R1.2 R2.1
FB2
  Top 0.254: IC11.3 47.49,15.99 47.75,16.26 52.26,16.26 R21.1
  Top 0.406: R20.2 R21.1
GND  (via drill 0.4, 0.6)
  Top 0.203: IC3.34 33.08,22.54 33.27,22.35 33.27,22.1 33.08,21.91 IC3.33 | IC2.3 20.38,54.29 20.19,54.1 20.19,53.85 20.38,53.66 IC2.4
  Top 0.254: IC5.142 46.86,68.96 46.61,69.22 41.27,69.22 v40.89,68.83 | IC5.3 42.8,64.9 42.55,65.15 42.55,67.18 v42.42,67.31 | IC5.4 42.41,64.4 v41.91,64.64 | IC5.116 59.86,65.83 v59.82,65.79 | IC5.137 49.36,66.97 v49.78,66.17 | IC5.125 55.36,66.94 v56.01,66.29 | IC5.133 51.36,66.75 v51.56,66.29 | IC5.104 64.62,63.9 64.01,64.39 v63.75,64.39 | IC5.95 64.04,59.4 v63.75,59.69 | IC5.83 64.28,53.4 v63.75,53.92 | IC5.53 53.86,44.72 v53.59,44.45 | IC5.42 48.36,47.22 v49.15,48.01 | IC5.63 58.86,47.69 v58.8,48.01 | IC5.68 61.36,45.1 v61.09,44.83 | v30.48,12.7 22.23,12.7 21.86,13.06 JMP1.3 | IC4.6 73.46,64.46 v73.53,64.39 | 54.29,9.21 v54.48,9.02 | IC11.2 47.99,14.08 IC11.V_4 47.99,13.86 IC11.13 | IC10.4 86.74,33.27 87.12,32.89 87.12,32 | 87.12,32 87.12,30.73 | 87.12,30.73 87.12,29.84 86.74,29.46 IC10.1 | IC10.2 87.12,30.73 | IC10.3 87.12,32
  Top 0.406: IC1.4 23.05,73.98 v23.11,74.04 23.11,75.56 22.8,75.88 IC1.1 | IC1.10 23.05,70.17 v23.11,70.1 | IC1.45 30.29,73.98 v30.23,74.04 30.23,75.44 30.67,75.88 IC1.48 | IC1.39 30.29,70.17 v30.23,70.1 | IC1.34 30.29,66.99 v30.23,67.06 | IC1.15 23.05,66.99 v23.11,67.06 | IC1.21 23.05,63.18 v23.11,63.12 23.11,61.72 22.67,61.28 IC1.24 | IC1.28 30.29,63.18 v30.23,63.12 30.23,61.72 30.67,61.28 IC1.25 | IC2.45 30.29,53.66 v30.23,53.72 30.23,55.12 30.67,55.56 IC2.48 | IC2.4 23.05,53.66 v23.11,53.72 23.11,55.12 22.67,55.56 IC2.1 | IC2.10 23.05,49.85 v23.11,49.78 | IC2.39 30.29,49.85 v30.23,49.78 | IC2.15 23.05,46.67 v23.11,46.74 | IC2.21 23.05,42.86 v23.11,42.8 23.11,41.4 22.67,40.96 IC2.24 | IC2.28 30.29,42.86 v30.23,42.8 30.23,41.4 30.67,40.96 IC2.25 | IC2.34 30.29,46.67 v30.23,46.74 | IC3.1 22.67,31.43 23.11,30.99 v23.11,29.59 23.05,29.53 IC3.4 | IC3.48 30.67,31.43 30.23,30.99 v30.23,29.59 30.29,29.53 IC3.45 | IC3.39 30.29,25.72 v30.23,25.65 | IC3.10 23.05,25.72 v23.11,25.65 | IC3.15 23.05,22.54 v23.11,22.61 | IC3.21 23.05,18.73 v23.11,18.67 | IC3.25 30.67,16.83 30.23,17.27 v30.23,18.67 30.29,18.73 IC3.28 | IC3.34 30.29,22.54 v30.23,22.61 | R1.1 78.74,4.32 v78.99,4.06 | 82.55,27.3 82.55,28.83 83.19,29.46 IC10.1 | 82.55,27.3 v83.06,27.3 | C8.2 82.55,27.3 | IC7.1 73.58,7.95 74.04,7.49 | R20.1 C19.1 54.29,9.21 | IC4.12 72.93,59.66 v73.28,59.31 | IC4.34 84.7,60.46 v85.34,59.82 | T1.E 47.13,79.88 v48.64,79.88
  Top 0.61: IC6.5 57.02,81.28 56.77,81.53 55.18,81.53 C1.2 v55.12,79.76
  Top 0.813: 30.48,10.29 IC9.2 30.48,12.45
  Top 1.016: v74.04,6.73 74.04,7.49 v74.42,7.87 | v74.42,9.02 v74.42,7.87 | v74.42,7.87 74.17,7.87 | v61.47,5.46 64.66,5.46 C2.2 | C3.1 68.52,5.46 v67.06,5.46 64.77,5.46 | v70.23,5.33 68.71,5.33 68.58,5.46 | v30.48,9.78 30.48,10.29 | 30.48,12.45 v30.48,12.7 | v82.42,13.84 82.42,15.6 C5.2 | v85.22,13.84 85.22,15.24 83.82,15.24 v83.82,13.84 | v66.04,13.84 66.04,15.24 | 66.04,15.24 C6.2 | v64.64,13.84 64.64,15.24 66.04,15.24 | v67.44,13.84 67.44,15.24 66.04,15.24
  Top 1.27: 74.17,7.87 74.04,8
  Bottom 0.406: 41.02,48.01 40.89,47.88 C9.2 37.53,48.19 IC8.6 | C41.2 84.42,60.74 v85.34,59.82 | C42.2 73.07,59.1 v73.28,59.31 | v70.48,75.18 72.64,75.18 BAT1.GND | v37.59,59.69 37.59,58.68 C7.2 37.53,57.6 IC8.3 | R19.1 55.88,74.55 54.23,76.2 54.23,78.87 v55.12,79.76 | R10.1 49.01,40.18 RP1.9
  Bottom 0.813: C13.2 24.45,65.72 v23.11,67.06 | C14.2 28.89,65.72 v30.23,67.06 | C12.2 28.89,71.44 v30.23,70.1 | C11.2 24.45,71.44 v23.11,70.1 | C21.2 24.45,51.12 v23.11,49.78 | C22.2 28.89,51.12 v30.23,49.78 | C23.2 24.45,45.4 v23.11,46.74 | C24.2 28.89,45.4 v30.23,46.74 | C32.2 28.89,26.99 v30.23,25.65 | C31.2 24.45,26.99 v23.11,25.65 | C33.2 24.45,21.27 v23.11,22.61 | C34.2 28.89,21.27 v30.23,22.61
  other vias: 66.8,67.31 67.94,67.31 67.94,69.98 68.33,45.09 67.18,46.99 39.37,46.99 40.77,45.72 40.77,48.26 41.02,67.31 43.18,25.53 43.18,26.8 48.26,25.53 53.34,25.53 53.34,26.8 48.26,26.8 41.66,5.97 42.93,5.97 48.13,6.6 51.56,6.6 71.25,83.31 81.15,83.31 82.04,75.06
  pour Ground: 5.08,0 5.08,88.9 88.9,88.9 88.9,0
  pour Bottom (no thermals): 60.83,50.93 48.39,50.93 48.39,63.37 60.83,63.37
  pour Bottom (no thermals): 66.42,65.15 68.33,65.15 68.33,70.36 66.42,70.36
  pour Bottom (no thermals): 66.42,44.45 66.42,49.78 68.71,49.78 68.71,44.45
  pour Bottom (no thermals): 42.8,44.58 38.99,44.58 38.99,48.64 40.51,48.64 40.51,50.16 42.8,50.16
  pour Bottom (no thermals): 42.8,64.26 40.64,64.26 40.64,69.47 42.8,69.47
  pour Bottom: 40.64,19.05 53.34,19.05 53.34,8.89 40.64,8.89
  pour Top (no thermals): 41.15,24.51 41.15,26.04 42.55,27.43 57.02,27.43 57.66,26.8 57.66,24.51
  pour Top (no thermals): 40.77,6.1 41.15,6.48 47.5,6.48 48.01,7.24 52.07,7.24 52.32,6.99 52.32,4.06 52.07,3.81 41.15,3.81 40.77,4.19
  pour Power (isolate 0.406, rank 2, no thermals): 44.07,14.86 49.91,14.86 49.91,13.08 44.07,13.08
  pour Power (isolate 0.406, rank 2, no thermals): 50.8,60.96 58.42,60.96 58.42,53.34 50.8,53.34
HAT_SCL
  Top 0.254: IC10.6 75.18,32 72.14,35.05 71.87,35.32 RP1.28
  Bottom 0.254: R17.2 77.12,30.48 RP1.28
HAT_SDA  (via drill 0.4)
  Top 0.254: RP1.27 71.87,38.24 73.15,36.96 73.15,34.8 74.68,33.27 IC10.5 82.3,33.27 v82.55,33.02
  Bottom 0.254: R18.1 v82.55,33.02
INT2A
  Top 0.406: IC3.17 20,21.27 arc90 17.78,19.05 17.78,16.47 arc-90 15.28,13.97 8.89,13.97 arc-90 5.59,16.51 5.59,83.57 arc-90 8.89,87.38 13.08,87.38 arc-90 INT2.TP
L1
  Top 0.406: IC11.8 41.92,12.46 40.89,11.43 39.98,10.77 L1.1
  pour Top (no thermals): 45.97,12.83 42.55,12.83 42.55,10.41 44.2,12.06 45.97,12.06
L2
  Top 0.406: IC11.7 41.92,15.48 40.89,16.51 39.98,17.17 L1.2
  pour Top (no thermals): 45.97,15.88 44.2,15.88 42.55,17.53 42.55,15.11 45.97,15.11
LB
  Top 0.254: IC4.39 77.52,64.46 71.12,70.87 64.14,70.87 62.87,69.6 IC5.110
LED_CTRL  (via drill 0.4)
  Top 0.254: IC5.123 56.36,67.08 v57.15,66.29 | v48.9,77.47 R22.1
  Bottom 0.254: v57.15,66.29 57.15,72.39 54.61,72.39 54.61,74.8 51.94,77.47 v48.9,77.47
LED_PWR
  Top 0.61: LED.1 16.51,77.6 17.4,76.71 22.23,76.71 22.73,77.22 R15.1
LED_RTN
  Top 0.61: T1.C 46.1,82.17 44.45,83.82 21.59,83.82 19.05,81.28 LED.2
MISO
  Top 0.254: IC5.57 55.86,43.84 arc45 56.05,43.4 59.65,39.79 arc45 60.36,39.5 62.2,39.5 arc-45 63.61,38.91 RP1.21
MOSI
  Top 0.254: IC5.56 55.36,43.73 arc45 55.65,43.03 57.33,41.35 arc-45 57.91,39.94 57.91,38.24 arc45 58.28,37.35 58.3,37.33 arc45 59.2,36.96 59.57,36.96 arc45 60.98,37.54 RP1.19
N$1
  Top 0.254: 61.21,38.23 60.71,37.34 61.85,37.85
N$2
  Top 0.254: 64.39,38.73 63.5,38.99 63.88,37.97
N$3
  Top 0.254: 66.93,38.73 66.04,38.99 66.42,37.97
N$8
  Top 0.254: R22.2 T1.B
N$9
  Top 0.406: IC2.14 20.38,47.31 18.87,45.79 R14.5
N$10
  Top 0.406: IC2.13 20,47.94 18.65,46.59 R14.6
N$11
  Top 0.406: IC2.12 19.62,48.58 18.4,47.39 R14.7
N$12
  Top 0.406: IC2.11 19.24,49.21 18.23,48.19 R14.8
N$13
  Top 0.406: IC2.9 20.89,50.48 20.32,49.91 18.92,49.91 18.6,49.6 R13.5
N$14
  Top 0.406: R13.6 18.43,50.4 18.71,50.67 20.07,50.67 20.51,51.12 IC2.8
N$15
  Top 0.406: R13.7 18.27,51.2 18.5,51.44 19.68,51.44 20.64,52.39 IC2.6
N$16
  Top 0.406: R13.8 18.1,52 18.3,52.2 19.3,52.2 20.13,53.02 IC2.5
OE
  Top 0.254: IC4.41 77.45,66.06 71.63,71.88 62.23,71.88 60.83,70.48 60.83,69.72 61.36,69.2 IC5.113
OUTPUT_EN
  Top 0.406: IC3.24 22.54,16.83 22.86,16.51 JMP1.2
PI_SCL
  Bottom 0.254: RASP_I2C.3 24.13,38.1 25.4,39.37 42.83,39.37 RP1.5
PI_SDA
  Bottom 0.254: RASP_I2C.4 27.05,36.83 39.37,36.83 39.95,36.83 RP1.3
RAS0
  Top 0.254: IC1.30 30.8,64.45 30.61,64.26 29.84,64.26 27.43,66.67 27.43,79.88 JMP3.1
RAS1
  Top 0.254: IC1.32 29.53,65.72 28.7,66.55 JMPB3.2
RPI_IRQ  (via drill 0.4)
  Top 0.254: IC5.80 64.35,51.9 v63.75,51.31
  Bottom 0.254: v63.75,51.31 62.48,51.31 61.34,50.16 61.34,46.48 60.33,45.47 60.33,41.27 58.17,39.12 58.17,35.05 58.93,34.29 62.81,34.29 RP1.22
SCE  (via drill 0.4)
  Top 0.254: IC5.61 57.86,47.68 v57.53,48.01
  Bottom 0.254: v57.53,48.01 57.66,47.88 57.66,34.8 58.67,33.78 64.84,33.78 RP1.24
SCL  (via drill 0.4)
  Top 0.254: IC5.97 64.44,60.4 62.48,62.36 v62.48,66.42 | v60.58,74.68 61.53,75.63 R4.1 61.53,77.91 60.83,78.61 IC6.8
  Bottom 0.254: v60.58,74.68 60.58,73.03 62.48,71.12 v62.48,66.42
SCLK
  Top 0.254: IC5.58 56.36,43.98 arc45 56.45,43.75 60.1,40.1 arc45 60.33,40.01 64.23,40.01 arc-45 65.64,39.42 RP1.23
SDA  (via drill 0.4)
  Top 0.254: IC5.112 61.86,69.58 v61.59,70.1 | v59.18,73.15 59.18,76.9 R3.1 59.12,78.17 59.56,78.61 IC6.7
  Bottom 0.254: v61.59,70.1 61.59,70.74 v59.18,73.15
SRA0
  Top 0.254: IC5.106 66.93,64.9 70.49,68.46 IC4.1
SRA1
  Top 0.254: IC5.105 67.19,64.4 70.46,67.66 IC4.2
SRA2
  Top 0.254: IC5.102 66.46,62.9 70.42,66.86 IC4.3
SRA3
  Top 0.254: IC5.101 66.72,62.4 70.38,66.06 IC4.4
SRA4
  Top 0.254: IC5.100 66.98,61.9 70.34,65.26 IC4.5
SRA5
  Top 0.254: IC4.18 68.58,54.86 68.04,55.4 IC5.87
SRA6
  Top 0.254: IC4.19 68.62,54.06 67.78,54.9 IC5.86
SRA7
  Top 0.254: IC4.20 68.66,53.26 67.52,54.4 IC5.85
SRA8
  Top 0.254: IC4.21 68.7,52.46 67.26,53.9 IC5.84
SRA9
  Top 0.254: IC4.22 68.73,51.66 68,52.4 IC5.81
SRA10
  Top 0.254: IC5.59 56.86,44.1 60.45,40.51 72.01,40.51 79.38,47.88 79.38,51.31 79.73,51.66 IC4.23
SRA11
  Top 0.254: IC5.60 57.36,44.37 60.71,41.02 71.75,41.02 78.87,48.13 78.87,51.56 79.77,52.46 IC4.24
SRA12
  Top 0.254: IC5.62 58.36,44.13 60.96,41.53 71.5,41.53 78.36,48.39 78.36,51.82 79.81,53.26 IC4.25
SRA13
  Top 0.254: IC5.64 59.36,43.89 61.21,42.04 71.25,42.04 77.85,48.64 77.85,52.07 79.84,54.06 IC4.26
SRA14
  Top 0.254: IC5.65 59.86,44.15 61.47,42.55 70.99,42.55 77.34,48.9 77.34,52.32 79.88,54.86 IC4.27
SRA15
  Top 0.254: IC4.42 77.41,66.86 71.88,72.39 61.98,72.39 60.2,70.61 60.2,69.6 60.86,68.93 IC5.114
SRA16
  Top 0.254: IC4.43 77.37,67.66 72.14,72.9 61.72,72.9 58.86,70.04 IC5.118
SRA17
  Top 0.254: IC4.44 77.33,68.46 72.39,73.41 61.47,73.41 58.36,70.3 IC5.119
SRA18
  Top 0.254: IC5.66 60.36,44.41 61.72,43.05 70.74,43.05 76.83,49.15 76.83,52.58 79.92,55.66 IC4.28
SRD0
  Top 0.254: IC5.99 67.24,61.4 69.5,63.66 IC4.7
SRD1
  Top 0.254: IC5.98 67.5,60.9 69.47,62.86 IC4.8
SRD2
  Top 0.254: IC5.96 67.77,59.9 69.94,62.06 IC4.9
SRD3
  Top 0.254: IC5.93 67.54,58.4 70.41,61.26 IC4.10
SRD4
  Top 0.254: IC5.92 67.81,57.9 68.77,58.86 IC4.13
SRD5
  Top 0.254: IC5.91 68.07,57.4 68.73,58.06 IC4.14
SRD6
  Top 0.254: IC5.90 68.33,56.9 68.69,57.26 IC4.15
SRD7
  Top 0.254: IC5.89 71.42,56.4 IC4.16
SRD8
  Top 0.254: IC5.69 61.86,44.19 62.48,43.56 70.48,43.56 76.33,49.4 76.33,52.83 79.96,56.46 IC4.29
SRD9
  Top 0.254: IC5.70 62.36,44.45 62.74,44.07 70.23,44.07 75.82,49.66 75.82,53.09 80,57.26 IC4.30
SRD10
  Top 0.254: IC4.31 80.03,58.06 75.31,53.34 75.31,49.91 73.79,48.39 67.44,48.39 66.93,48.9 IC5.74
SRD11
  Top 0.254: IC4.32 80.07,58.86 74.8,53.59 74.8,50.16 73.53,48.9 67.69,48.9 67.19,49.4 IC5.75
SRD12
  Top 0.254: IC4.35 81.71,61.26 74.3,53.85 74.3,50.42 73.28,49.4 67.94,49.4 67.45,49.9 IC5.76
SRD13
  Top 0.254: IC4.36 81.75,62.06 73.79,54.1 73.79,50.67 73.03,49.91 68.2,49.91 67.71,50.4 IC5.77
SRD14
  Top 0.254: IC4.37 81.78,62.86 73.28,54.36 73.28,50.93 72.77,50.42 68.45,50.42 67.97,50.9 IC5.78
SRD15
  Top 0.254: IC4.38 81.82,63.66 72.77,54.61 72.77,51.18 72.52,50.93 68.71,50.93 68.23,51.4 IC5.79
SW
  Top 0.254: 76.2,10.16 75.51,10.16 L2.1
  Top 0.406: C4.2 76.2,10.16
  Top 0.61: 72.77,10.79 74.88,10.79 L2.1 | IC7.2 72.39,9.27
  Top 1.016: 72.39,9.27 72.39,10.41 72.77,10.79
TCK  (via drill 0.4)
  Top 0.254: IC5.18 44.71,57.4 v45.59,58.42
  Power 0.254: v45.59,58.42 45.34,58.67 42.04,58.67 40.51,57.15 40.51,56.39 44.96,51.94 46.35,51.94 49.91,48.39 49.91,39.91 RP1.11
  Bottom 0.254: R10.2 51.55,39.81 RP1.11
TDI  (via drill 0.4)
  Top 0.254: IC5.19 45.72,56.9 v45.59,56.77
  Power 0.254: v45.59,56.77 45.59,56.52 44.7,55.63 44.7,54.48 45.72,53.47 47.12,53.47 51.31,49.28 53.72,49.28 60.2,42.8 60.2,37.47 59.44,36.7 58.2,36.7 RP1.16
  Bottom 0.254: R9.1 55.37,38.74 55.37,36.83 56.47,35.73 RP1.16
TDO  (via drill 0.4)
  Top 0.254: IC5.20 41.64,56.4 v41.27,56.77
  Power 0.254: v41.27,56.77 41.27,56.39 45.21,52.45 46.61,52.45 50.42,48.64 50.42,41.94 RP1.13
TMS  (via drill 0.4)
  Top 0.254: IC5.16 42.91,58.4 v42.29,57.78
  Power 0.254: v42.29,57.78 42.29,56.13 45.47,52.96 46.86,52.96 50.93,48.9 50.93,43.97 RP1.15
  Bottom 0.254: R8.1 56.63,39.89 RP1.15
UB
  Top 0.254: IC4.40 77.49,65.26 71.37,71.37 63.88,71.37 62.36,69.85 IC5.111
VCC/2  (via drill 0.6)  (1 unrouted)
  Top 0.406: C8.1 78.61,27.75 77.6,28.77 v77.6,28.83 77.6,29.46 IC10.8
  Top 0.61: R16.2 77.53,28.89 v77.6,28.83
  Bottom 0.406: RP1.17 59.17,38.24 60.45,36.96 70.1,36.96 70.61,36.45 70.61,35.05 76.83,28.83 v77.6,28.83 | 77.6,29.02 v77.6,28.83 | v77.6,28.83 79.31,28.83 80.26,28.83 80.9,29.46 80.9,30.42 R17.1 80.96,30.55 80.39,31.11 80.39,31.37 79.63,32.13 79.63,32.45 R18.2
VINA
  Top 0.254: IC11.12 47.49,11.95 47.88,11.56 50.55,11.56 | 50.55,11.56 51.63,11.56 C19.2 | IC11.1 49.92,15.48 50.55,14.86 50.55,11.56
WE
  Top 0.254: IC4.17 68.54,55.66 68.31,55.9 IC5.88
WP  (via drill 0.6)
  Top 0.254: IC10.7 77.02,30.73 R16.1 75.25,30.8 73.66,29.21 73.66,26.67 74.93,25.4 83.44,25.4 v85.34,27.3

## Text on the board
Top: Top layer
Ground: Ground layer
Power: Power layer
Bottom: Bottom layer | rev 1.2
tPlace: RAS0 | RAS1 | ACT. | 1 | 1 GND / 2 +3V3 / 3 SCL / 4 SDA | PD 2020 | M. Rönndahl / N. Ekström | v1.2
tNames: JLCJLCJLCJLC | Raspberry Pi GPIO header | 1
bNames: Insert here -> | CR2032